# Altium schematic sheet Sheet3.SchDoc
size A4; SheetNumber: 1; SheetTotal: 3
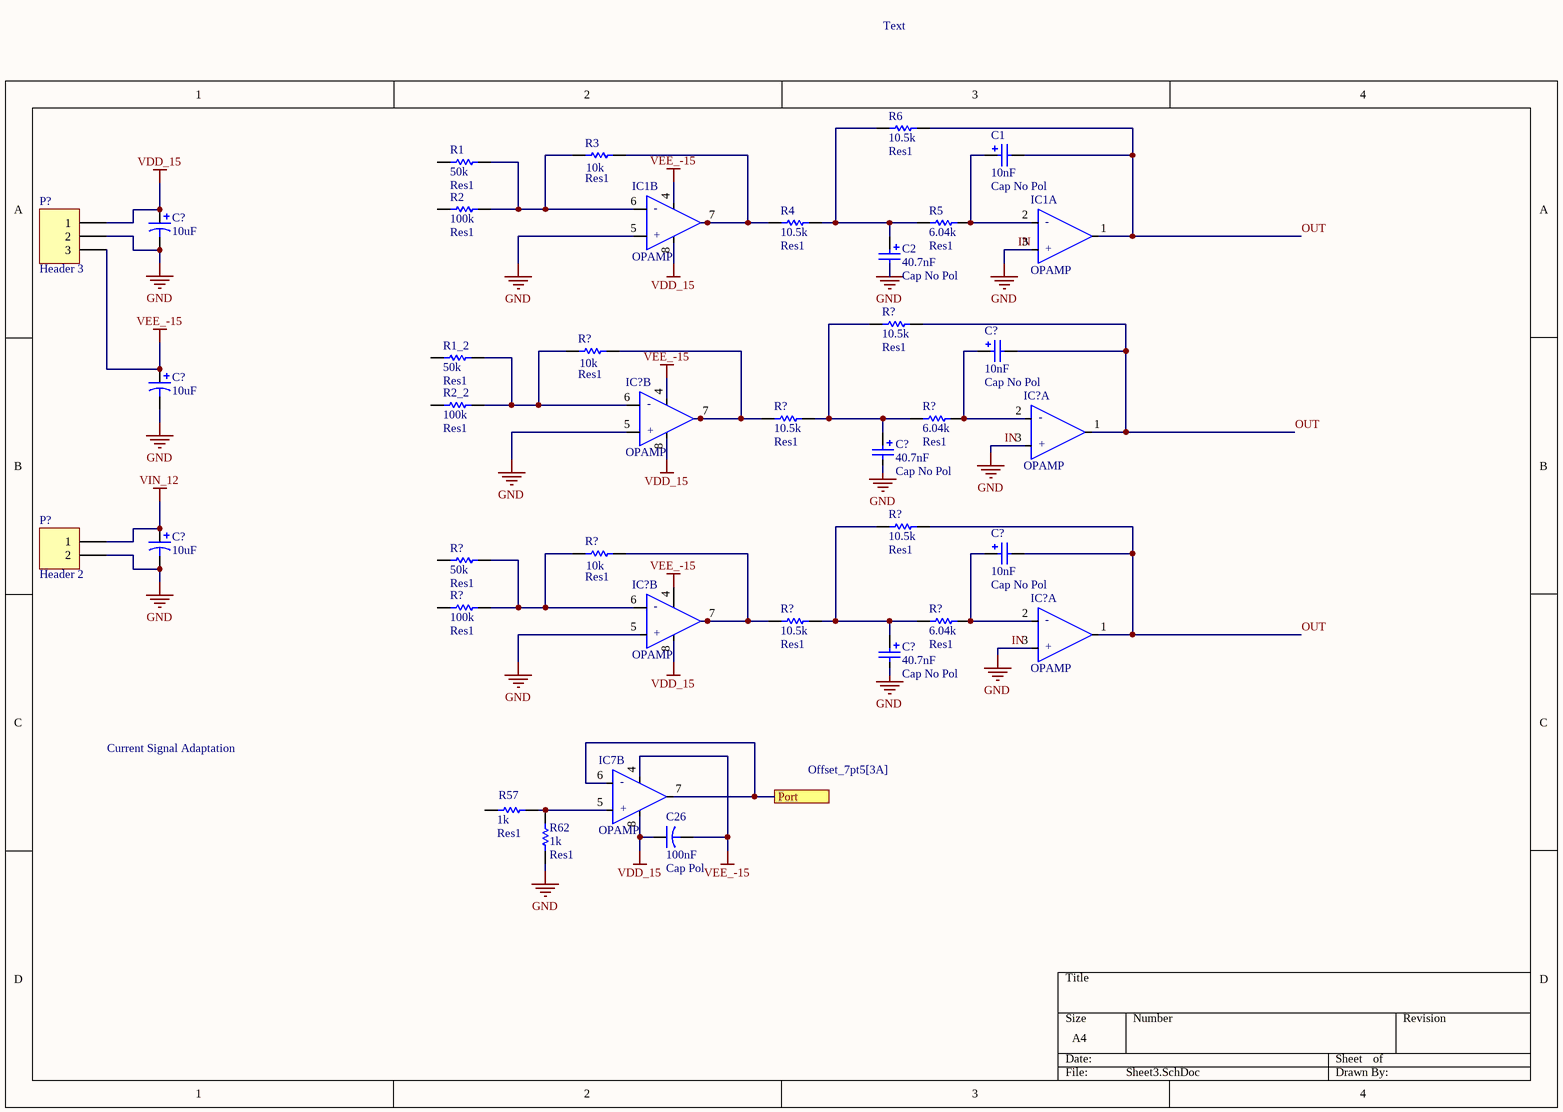
[diagram p0: Sheet3.SchDoc]

## Parts
(Parts that share a designator on the sheet are numbered #1, #2 ... from top to bottom, then left to right.)
C1  Cap No Pol  value 10nF  [RAD-0.1]
C2  Cap No Pol  value 40.7nF  [RAD-0.1]
C26  Cap Pol  value 100nF  [CAPR5-4X5]
C?#1  value 10uF  [RAD-0.2]  (hidden comment: Cap Pol1)
C?#2  Cap No Pol  value 10nF  [RAD-0.1]
C?#3  value 10uF  [RAD-0.2]  (hidden comment: Cap Pol1)
C?#4  Cap No Pol  value 40.7nF  [RAD-0.1]
C?#5  value 10uF  [RAD-0.2]  (hidden comment: Cap Pol1)
C?#6  Cap No Pol  value 10nF  [RAD-0.1]
C?#7  Cap No Pol  value 40.7nF  [RAD-0.1]
IC1  OPAMP  [DIP-8]  (parts A,B of 2)
IC7  OPAMP  [DIP-8]  (part B of 2)
IC?#1  OPAMP  [DIP-8]  (part B of 2)
IC?#2  OPAMP  [DIP-8]  (part A of 2)
IC?#3  OPAMP  [DIP-8]  (part B of 2)
IC?#4  OPAMP  [DIP-8]  (part A of 2)
P?#1  Header 3  [HDR1X3]
P?#2  Header 2  [HDR1X2]
R1  Res1  value 50k  [AXIAL-0.3]
R1_2  Res1  value 50k  [AXIAL-0.3]
R2  Res1  value 100k  [AXIAL-0.3]
R2_2  Res1  value 100k  [AXIAL-0.3]
R3  Res1  value 10k  [AXIAL-0.3]
R4  Res1  value 10.5k  [AXIAL-0.3]
R5  Res1  value 6.04k  [AXIAL-0.3]
R6  Res1  value 10.5k  [AXIAL-0.3]
R57  Res1  value 1k  [AXIAL-0.3]
R62  Res1  value 1k  [AXIAL-0.3]
R?#1  Res1  value 10.5k  [AXIAL-0.3]
R?#2  Res1  value 10k  [AXIAL-0.3]
R?#3  Res1  value 10.5k  [AXIAL-0.3]
R?#4  Res1  value 6.04k  [AXIAL-0.3]
R?#5  Res1  value 10.5k  [AXIAL-0.3]
R?#6  Res1  value 10k  [AXIAL-0.3]
R?#7  Res1  value 50k  [AXIAL-0.3]
R?#8  Res1  value 100k  [AXIAL-0.3]
R?#9  Res1  value 10.5k  [AXIAL-0.3]
R?#10  Res1  value 6.04k  [AXIAL-0.3]

## Ports
Port (see Offset_7pt5[3A])

## Nets
IN: C2.2 C?#1.2 C?#3.2 C?#4.2 C?#5.2 C?#7.2 IC1.3(IN_A_+) IC?#2.3(IN_A_+) IC?#3.5(IN_B_+) IC?#4.3(IN_A_+) P?#1.2 P?#2.2 R62.1  [also labelled GND]
VDD_15: C26.1 C?#1.1 IC1.8(V+) IC7.8(V+) IC?#1.8(V+) IC?#3.8(V+) P?#1.1
VEE_-15: C26.2 C?#3.1 IC1.4(-V) IC7.4(-V) IC?#1.4(-V) P?#1.3
VIN_12: C?#5.1 P?#2.1
OUT: C1.2 C?#2.2 C?#6.2 IC1.1(OUT_A) IC?#2.1(OUT_A) IC?#4.1(OUT_A) R6.2 R?#1.2 R?#5.2
Port: IC7.6(IN_B_-) IC7.7(OUT_B) ; port Port
NetC1_1: C1.1 IC1.2(IN_A_-) R5.2
NetC2_1: C2.1 R4.2 R5.1 R6.1
NetC?#2_1: C?#2.1 IC?#2.2(IN_A_-) R?#4.2
NetC?#4_1: C?#4.1 R?#1.1 R?#3.2 R?#4.1
NetC?#6_1: C?#6.1 IC?#4.2(IN_A_-) R?#10.2
NetC?#7_1: C?#7.1 R?#5.1 R?#9.2 R?#10.1
NetIC1_7: IC1.7(OUT_B) R3.2 R4.1
NetIC7_5: IC7.5(IN_B_+) R57.2 R62.2
NetIC?#1_7: IC?#1.7(OUT_B) R?#2.2 R?#3.1
NetIC?#3_7: IC?#3.7(OUT_B) R?#6.2 R?#9.1
NetR1_2: R1.2 R2.2 R3.1
NetR1_2_2: R1_2.2 R2_2.2 R?#2.1
NetR?#6_1: R?#6.1 R?#7.2 R?#8.2

Not connected (* = marked no-connect by the designer): IC1 5(IN_B_+) 6(IN_B_-); IC?#1 5(IN_B_+) 6(IN_B_-); IC?#3 4(-V) 6(IN_B_-); R1 1; R1_2 1; R2 1; R2_2 1; R57 1; R?#7 1; R?#8 1

## Notes on the sheet
- Text
- Current Signal Adaptation
- Labels drawn without touching a wire or pin: VEE_-15
- (in symbol ADTL082, part A) -; +
- (in symbol ADTL082, part B) -; +

## Library data of the parts
C1 C2 C?#2 C?#4 C?#6 C?#7 = Cap No Pol: Polarized Capacitor (Radial); Published: 8-Jun-2000; LatestRevisionDate: 17-Jul-2002; LatestRevisionNote: Re-released for DXP Platform.; PackageReference: RB7.6-15; Publisher: Altium Limited; PackageDescription: Polarized Capacitor (Radial); 2 Leads
C26 = Cap Pol: Capacitor; Published: 23-Sep-2002; PackageReference: CAPR5-4X5; Publisher: Altium Limited; PackageDescription: Capacitor; 2 Leads
C?#1 C?#3 C?#5 = Cap Pol1: Polarized Capacitor (Radial); Published: 8-Jun-2000; LatestRevisionDate: 17-Jul-2002; LatestRevisionNote: Re-released for DXP Platform.; PackageReference: RB7.6-15; Publisher: Altium Limited; PackageDescription: Polarized Capacitor (Radial); 2 Leads
IC1 IC7 IC?#1-IC?#4 = ADTL082
P?#1 = Header 3: Header, 3-Pin; LatestRevisionDate: 17-Jul-2002; LatestRevisionNote: Re-released for DXP Platform.; Publisher: Altium Limited
P?#2 = Header 2: Header, 2-Pin; LatestRevisionDate: 17-Jul-2002; LatestRevisionNote: Re-released for DXP Platform.; Publisher: Altium Limited
R1 R1_2 R2 R2_2 R3-R6 R57 R62 R?#1-R?#10 = Res1: Resistor; Published: 8-Jun-2000; LatestRevisionDate: 17-Jul-2002; LatestRevisionNote: Re-released for DXP Platform.; PackageReference: AXIAL-0.3; Publisher: Altium Limited; PackageDescription: Axial Device, Thru-Hole; 2 Leads; 0.3 in Pin Spacing